# Altium schematic sheet TI_DSP.SchDoc: Sample Sheet Title
size B; Date: MM/DD/YYYY; Author: Sample Author; Organization: ORGANIZATION; Address1: ADDRESS 1; Address2: ADDRESS 2; Address3: ADDRESS 3; Address4: ADDRESS 4; Revision: -; SheetNumber: 3; SheetTotal: 6; ENG_APP_DATE: --/--/--; DSN_APP_DATE: --/--/--; CHK_APP_DATE: --/--/--
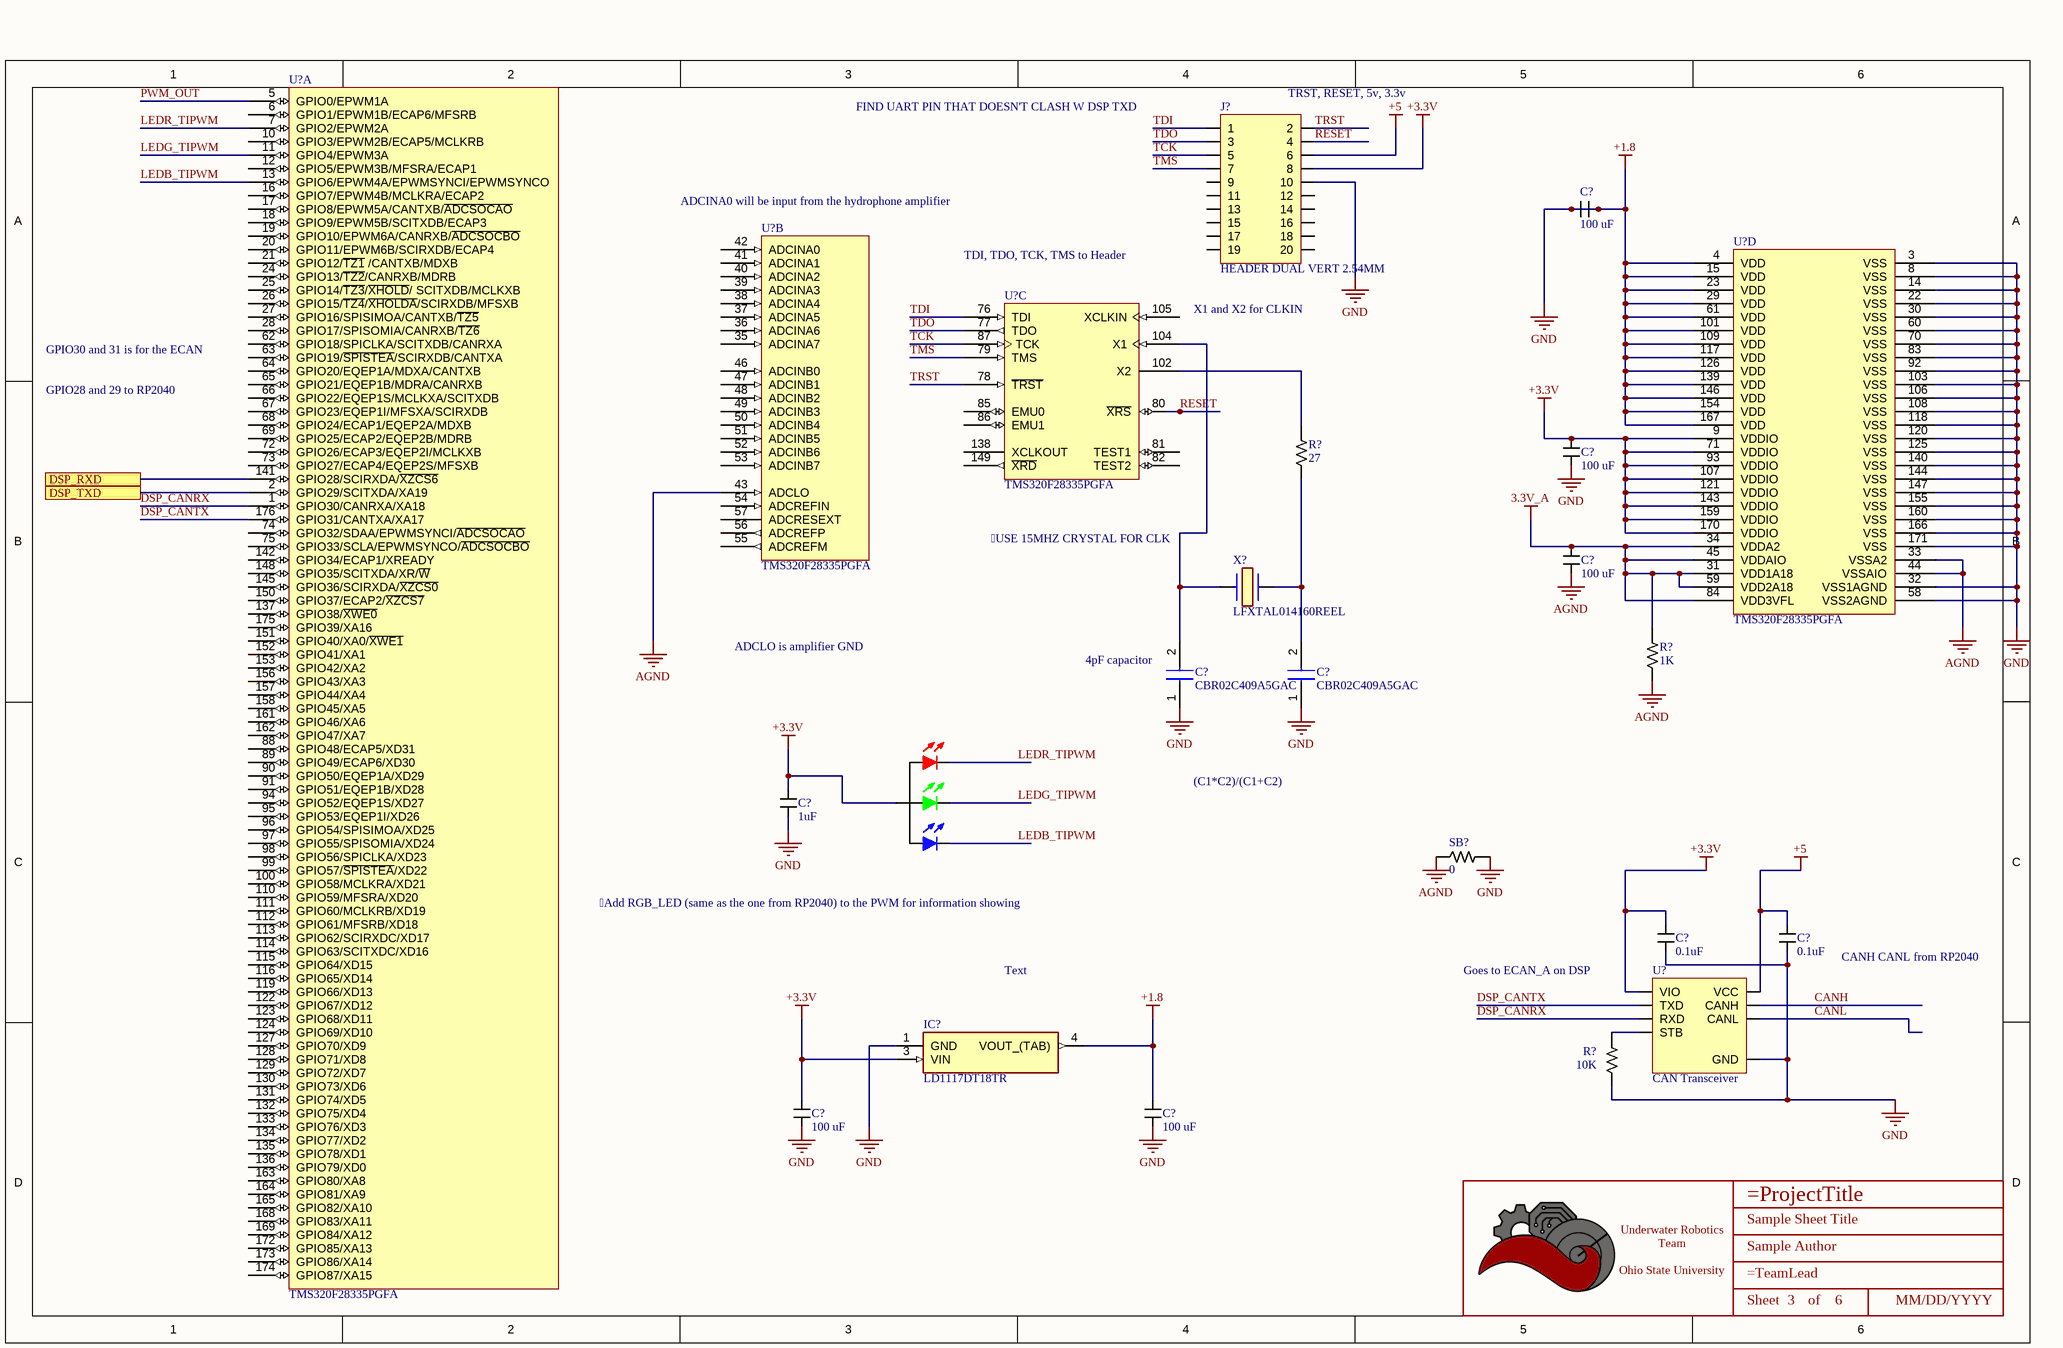
[diagram p0: TI_DSP.SchDoc]

## Parts
(Parts that share a designator on the sheet are numbered #1, #2 ... from top to bottom, then left to right.)
*  Title_Block  [LOGO]  (value not drawn)  (graphical)
C?#1  Value (uF): 100 uF  [CAPACITOR_0603]  (hidden comment: 100uF Ceramic 6.3V)
C?#2  Value (uF): 100 uF  [CAPACITOR_0603]  (hidden comment: 100uF Ceramic 6.3V)
C?#3  Value (uF): 100 uF  [CAPACITOR_0603]  (hidden comment: 100uF Ceramic 6.3V)
C?#4  CBR02C409A5GAC  [CAPC0603X33N]
C?#5  CBR02C409A5GAC  [CAPC0603X33N]
C?#6  value 1uF  [CAPACITOR_0603]  (hidden comment: 1uF Ceramic 16V)
C?#7  value 0.1uF  [CAPACITOR_0402]  (hidden comment: 100nF Ceramic 25V)
C?#8  value 0.1uF  [CAPACITOR_0402]  (hidden comment: 100nF Ceramic 25V)
C?#9  Value (uF): 100 uF  [CAPACITOR_0603]  (hidden comment: 100uF Ceramic 6.3V)
C?#10  Value (uF): 100 uF  [CAPACITOR_0603]  (hidden comment: 100uF Ceramic 6.3V)
D?  EASV3015RGBA0  [LED_4-SMD]  (value not drawn)
IC?  LD1117DT18TR  [TO228P972X240-3N]
J?  HEADER DUAL VERT 2.54MM  [HEADER_2x10PIN_2.54MM]
R?#1  Value  (Ohms): 27  [RESISTOR_0603]  (hidden comment: 27 Ohm 5% 1/8W)
R?#2  Value  (Ohms): 1K  [RESISTOR_0603]  (hidden comment: 1k Ohm 5% 1/8W)
R?#3  Value  (Ohms): 10K  [RESISTOR_0402]  (hidden comment: 10k Ohm 1% 1/16W)
SB?  Value  (Ohms): 0  [RESISTOR_0603]  (hidden comment: 0 Ohm Jumper No Fit)
U?#1  TMS320F28335PGFA  [PGF0176A_M]  (part A of 4)
U?#2  TMS320F28335PGFA  [PGF0176A_M]  (part B of 4)
U?#3  TMS320F28335PGFA  [PGF0176A_M]  (part D of 4)
U?#4  TMS320F28335PGFA  [PGF0176A_M]  (part C of 4)
U?#5  CAN Transceiver  [SOIC-8]
X?  LFXTAL014160REEL  [LFXTAL014160REEL]

## Ports
DSP_RXD, DSP_TXD

## Nets
3.3V_A: C?#3.1 R?#2.1 U?#3.31(VDD1A18) U?#3.34(VDDA2) U?#3.45(VDDAIO) U?#3.59(VDD2A18) U?#3.84(VDD3VFL)
+1.8: C?#1.1 C?#1.2 C?#2.2 C?#4.1 C?#5.1 C?#6.2 C?#7.2 C?#8.2 C?#9.2 C?#10.1 C?#10.2 IC?.1(GND) IC?.4(VOUT_(TAB)) J?.10 R?#3.2 SB?.1 U?#3.3(VSS) U?#3.4(VDD) U?#3.8(VSS) U?#3.14(VSS) U?#3.15(VDD) U?#3.22(VSS) U?#3.23(VDD) U?#3.29(VDD) U?#3.30(VSS) U?#3.32(VSS1AGND) U?#3.58(VSS2AGND) U?#3.60(VSS) U?#3.61(VDD) U?#3.70(VSS) U?#3.83(VSS) U?#3.92(VSS) U?#3.101(VDD) U?#3.103(VSS) U?#3.106(VSS) U?#3.108(VSS) U?#3.109(VDD) U?#3.117(VDD) U?#3.118(VSS) U?#3.120(VSS) U?#3.125(VSS) U?#3.126(VDD) U?#3.139(VDD) U?#3.140(VSS) U?#3.144(VSS) U?#3.146(VDD) U?#3.147(VSS) U?#3.154(VDD) U?#3.155(VSS) U?#3.160(VSS) U?#3.166(VSS) U?#3.167(VDD) U?#3.171(VSS) U?#5.2(GND)  [also labelled GND]
+3.3V: C?#2.1 C?#6.1 C?#7.1 C?#9.1 D?.1 IC?.3(VIN) J?.8 U?#3.9(VDDIO) U?#3.71(VDDIO) U?#3.93(VDDIO) U?#3.107(VDDIO) U?#3.121(VDDIO) U?#3.143(VDDIO) U?#3.159(VDDIO) U?#3.170(VDDIO) U?#5.5(VIO)
+5: C?#8.1 J?.6 U?#5.3(VCC)
AGND: C?#3.2 R?#2.2 SB?.2 U?#2.43(ADCLO) U?#3.33(VSSA2) U?#3.44(VSSAIO)
CANH: U?#5.7(CANH)
CANL: U?#5.6(CANL)
DSP_CANRX: U?#1.1(GPIO30/CANRXA/XA18) U?#5.4(RXD)
DSP_CANTX: U?#1.176(GPIO31/CANTXA/XA17) U?#5.1(TXD)
DSP_RXD: U?#1.141(GPIO28/SCIRXDA/~{XZCS6}) ; port DSP_RXD
DSP_TXD: U?#1.2(GPIO29/SCITXDA/XA19) ; port DSP_TXD
LEDB_TIPWM: D?.2 U?#1.13(GPIO6/EPWM4A/EPWMSYNCI/EPWMSYNCO)
LEDG_TIPWM: D?.3 U?#1.11(GPIO4/EPWM3A)
LEDR_TIPWM: D?.4 U?#1.7(GPIO2/EPWM2A)
PWM_OUT: U?#1.5(GPIO0/EPWM1A)
RESET: J?.4 U?#4.80(~{XRS})
TCK: J?.5 U?#4.87(TCK)
TDI: J?.1 U?#4.76(TDI)
TDO: J?.3 U?#4.77(TDO)
TMS: J?.7 U?#4.79(TMS)
TRST: J?.2 U?#4.78(~{TRST})
NetC?#4_2: C?#4.2 U?#4.104(X1) X?.1
NetC?#5_2: C?#5.2 R?#1.2 X?.2
NetR?#1_1: R?#1.1 U?#4.102(X2)
NetR?#3_1: R?#3.1 U?#5.8(STB)

Not connected (* = marked no-connect by the designer): J? 9 11 12 13 14 15 16 17 18 19 20; U?#1 6(GPIO1/EPWM1B/ECAP6/MFSRB) 10(GPIO3/EPWM2B/ECAP5/MCLKRB) 12(GPIO5/EPWM3B/MFSRA/ECAP1) 16(GPIO7/EPWM4B/MCLKRA/ECAP2) 17(GPIO8/EPWM5A/CANTXB/~{ADCSOCAO}) 18(GPIO9/EPWM5B/SCITXDB/ECAP3) 19(GPIO10/EPWM6A/CANRXB/~{ADCSOCBO}) 20(GPIO11/EPWM6B/SCIRXDB/ECAP4) 21(GPIO12/~{TZ1}_/CANTXB/MDXB) 24(GPIO13/~{TZ2}/CANRXB/MDRB) 25(GPIO14/~{TZ3}/~{XHOLD}/_SCITXDB/MCLKXB) 26(GPIO15/~{TZ4}/~{XHOLDA}/SCIRXDB/MFSXB) 27(GPIO16/SPISIMOA/CANTXB/~{TZ5}) 28(GPIO17/SPISOMIA/CANRXB/~{TZ6}) 62(GPIO18/SPICLKA/SCITXDB/CANRXA) 63(GPIO19/~{SPISTEA}/SCIRXDB/CANTXA) 64(GPIO20/EQEP1A/MDXA/CANTXB) 65(GPIO21/EQEP1B/MDRA/CANRXB) 66(GPIO22/EQEP1S/MCLKXA/SCITXDB) 67(GPIO23/EQEP1I/MFSXA/SCIRXDB) 68(GPIO24/ECAP1/EQEP2A/MDXB) 69(GPIO25/ECAP2/EQEP2B/MDRB) 72(GPIO26/ECAP3/EQEP2I/MCLKXB) 73(GPIO27/ECAP4/EQEP2S/MFSXB) 74(GPIO32/SDAA/EPWMSYNCI/~{ADCSOCAO}) 75(GPIO33/SCLA/EPWMSYNCO/~{ADCSOCBO}) 88(GPIO48/ECAP5/XD31) 89(GPIO49/ECAP6/XD30) 90(GPIO50/EQEP1A/XD29) 91(GPIO51/EQEP1B/XD28) 94(GPIO52/EQEP1S/XD27) 95(GPIO53/EQEP1I/XD26) 96(GPIO54/SPISIMOA/XD25) 97(GPIO55/SPISOMIA/XD24) 98(GPIO56/SPICLKA/XD23) 99(GPIO57/~{SPISTEA}/XD22) 100(GPIO58/MCLKRA/XD21) 110(GPIO59/MFSRA/XD20) 111(GPIO60/MCLKRB/XD19) 112(GPIO61/MFSRB/XD18) 113(GPIO62/SCIRXDC/XD17) 114(GPIO63/SCITXDC/XD16) 115(GPIO64/XD15) 116(GPIO65/XD14) 119(GPIO66/XD13) 122(GPIO67/XD12) 123(GPIO68/XD11) 124(GPIO69/XD10) 127(GPIO70/XD9) 128(GPIO71/XD8) 129(GPIO72/XD7) 130(GPIO73/XD6) 131(GPIO74/XD5) 132(GPIO75/XD4) 133(GPIO76/XD3) 134(GPIO77/XD2) 135(GPIO78/XD1) 136(GPIO79/XD0) 137(GPIO38/~{XWE0}) 142(GPIO34/ECAP1/XREADY) 145(GPIO36/SCIRXDA/~{XZCS0}) 148(GPIO35/SCITXDA/XR/~{W}) 150(GPIO37/ECAP2/~{XZCS7}) 151(GPIO40/XA0/~{XWE1}__) 152(GPIO41/XA1) 153(GPIO42/XA2) 156(GPIO43/XA3) 157(GPIO44/XA4) 158(GPIO45/XA5) 161(GPIO46/XA6) 162(GPIO47/XA7) 163(GPIO80/XA8) 164(GPIO81/XA9) 165(GPIO82/XA10) 168(GPIO83/XA11) 169(GPIO84/XA12) 172(GPIO85/XA13) 173(GPIO86/XA14) 174(GPIO87/XA15) 175(GPIO39/XA16); U?#2 35(ADCINA7) 36(ADCINA6) 37(ADCINA5) 38(ADCINA4) 39(ADCINA3) 40(ADCINA2) 41(ADCINA1) 42(ADCINA0) 46(ADCINB0) 47(ADCINB1) 48(ADCINB2) 49(ADCINB3) 50(ADCINB4) 51(ADCINB5) 52(ADCINB6) 53(ADCINB7) 54(ADCREFIN) 55(ADCREFM) 56(ADCREFP) 57(ADCRESEXT); U?#4 81(TEST1) 82(TEST2) 85(EMU0) 86(EMU1) 105(XCLKIN) 138(XCLKOUT) 149(~{XRD})

## Notes on the sheet
- FIND UART PIN THAT DOESN'T CLASH W DSP TXD
- (near J?) TRST, RESET, 5v, 3.3v
- (near U?#2) ADCINA0 will be input from the hydrophone amplifier
- TDI, TDO, TCK, TMS to Header
- GPIO30 and 31 is for the ECAN
- X1 and X2 for CLKIN
- GPIO28 and 29 to RP2040
- USE 15MHZ CRYSTAL FOR CLK
- ADCLO is amplifier GND
- (near C?#4) 4pF capacitor
- (C1*C2)/(C1+C2)
- Add RGB_LED (same as the one from RP2040) to the PWM for information showing
- CANH CANL from RP2040
- Text
- Goes to ECAN_A on DSP
- DWG. NO.
- REV.
- SHT.
- THIS DOCUMENT AND THE DATA DISCLOSED HEREIN OR HEREWITH IS THE PROPERTY OF ALTIUM LIMITED AND MAY BE FREELY DISTRIBUTED IN WHOLE. NO RIGHTS ARE RESERVED OR EXPRESS OR IMPLIED WARANTEE GIVEN.
- REVISION
- DESCRIPTION
- DATE
- APPROVED
- ENG:
- APPROVALS
- PROJECT
- DSN:
- CHK:
- REFERENCE DOCUMENTS
- PROJECT REVISION:
- TITLE
- DOCUMENT REVISION:
- DESIGN ITEM:
- BOM:
- FAB DWG:
- PCB DWG:
- ASSY DWG:
- SCALE:
- SIZE
- B
- CAGE CODE
- FILE NAME
- DWG NO.
- SHEET
- OF
- REV
- (in symbol Title_Block) Underwater Robotics Team / Ohio State University; Sheet; of

## Library data of the parts
* = Title_Block: UWRT Schematic Title Block Template / Created June 2021, Dylan Trainor
C?#1-C?#3 C?#9 C?#10 = CAPACITOR_100uF_0603: Cap 100uF 6.3V +/-20% / Ceramic 0603; Made By: Dylan Trainor; ComponentLink1Description: Digikey; ComponentLink1URL: https://www.digikey.com/en/products/detail/samsung-electro-mechanics/CL10A106MQ8NNNC/3886777; Tolerance: +/- 20%; Voltage: 6.3V; Supplier 1: RSComponents; Supplier Part Number 1: 6911206
C?#4 C?#5 = CBR02C409A5GAC: Capacitor; Manufacturer_Name: KEMET; Datasheet Link: http://www.kemet.com/Lists/ProductCatalog/Attachments/490/KEM_C1030_CBR_SMD.pdf; Height: 0.33mm; Manufacturer_Part_Number: CBR02C409A5GAC
C?#6 = CAPACITOR_1uF_0603: Cap 1uF 16V +/-10% / Ceramic 0603; Made By: Flip B; Tolerance: +/- 10%; Voltage: 16V; Supplier 1: Digi-Key; Supplier Part Number 1: 399-7847-1-ND
C?#7 C?#8 = CAPACITOR_0.1uF_0402: Cap 100nF 25V +/-10% / Ceramic 0402; Made By: Robert Pafford; Tolerance: +/- 10%; Voltage: 25V; Supplier 1: Digi-Key; Supplier Part Number 1: 478-7868-1-ND
D? = LED_RGB_RA_4SMD: LED RGB CLEAR 4SMD R/A; Made By: Robert Pafford; Red Forward Voltage: 2.0V; Red Forward Current: 25mA; Green Forward Voltage: 3.3V; Blue Forward Current: 20mA; ComponentLink1Description: Datasheet; ComponentLink1URL: https://everlightamericas.com/index.php?controller=attachment&id_attachment=3220; Package: 4-SMD; Green Forward Current: 25mA; Blue Forward Voltage: 3.3V; Color: RGB; Supplier 1: Digi-Key; Supplier Part Number 1: 1080-1502-1-ND; Supplier 2: Mouser; Supplier Part Number 2: 638-EASV3015RGBA0
IC? = LD1117DT18TR: Integrated Circuit; Manufacturer_Name: STMicroelectronics; Datasheet Link: http://www.st.com/st-web-ui/static/active/en/resource/technical/document/datasheet/CD00000544.pdf; Height: 2.4mm; Manufacturer_Part_Number: LD1117DT18TR; Mouser Part Number: 511-LD1117DT18-TR; Mouser Price/Stock: https://www.mouser.co.uk/ProductDetail/STMicroelectronics/LD1117DT18TR?qs=rkyzKKi%2FrgiTGfkwrcFd%252BA%3D%3D; Arrow Part Number: LD1117DT18TR; Arrow Price/Stock: https://www.arrow.com/en/products/ld1117dt18tr/stmicroelectronics?region=nac
J? = HEADER_2x10PIN_2.54MM: CONN HEADER VERT 20POS 2.54MM; Made By: Tyson Nguyen; Supplier 1: Digi-Key; Supplier Part Number 1: Z8747-ND
R?#1 = RESISTOR_27_0603: RES 27 OHM 5% 1/8W 0603; Tolerance: +/- 5%; Made By: Robert Pafford; ComponentLink1Description: Datasheet; ComponentLink1URL: https://www.bourns.com/docs/product-datasheets/CRxxxxx.pdf; Wattage: 1/8W; Supplier: Digikey; Digikey Part Numer: CR0603-JW-104ELFTR-ND; Supplier 1: Digi-Key; Supplier Part Number 1: 2019-RK73B1JTTD270JCT-ND
R?#2 = RESISTOR_1K_0603: RES 1k OHM 5% 1/8W 0603; Tolerance: +/- 5%; Made By: Robert Pafford; ComponentLink1Description: Datasheet; ComponentLink1URL: https://www.bourns.com/docs/product-datasheets/CRxxxxx.pdf; Wattage: 1/8W; Supplier: Digikey; Digikey Part Numer: CR0603-JW-104ELFTR-ND; Supplier 1: Digi-Key; Supplier Part Number 1: 2019-RK73B1JTTD102JCT-ND
R?#3 = RESISTOR_10K_0402: RES 10k OHM 1% 1/16W 0402; Tolerance: +/- 1%; Made By: Robert Pafford; Wattage: 1/16W; Supplier: Digikey; Digikey Part Numer: CR0603-JW-104ELFTR-ND; Supplier 1: Digi-Key; Supplier Part Number 1: YAG3436CT-ND
SB? = JUMPER_0_0603: 0 Ohm Jumper No Fit for Solder Bridge; Made By: Robert Pafford; ComponentLink1Description: Digikey; ComponentLink1URL: https://www.digikey.com/en/products/detail/koa-speer-electronics-inc/RK73B1JTTD101J/9844701
U?#1-U?#4 = CMP-0546-00022-3: Delfino Microcontroller, 1.9 V Core, 3.3 V I/O Design, 256 K x 16 Flash, 34 K x 16 SARAM, 12-Bit ADC, 16 Channels, -40 to 85 degC, 176-pin LQFP (PGF), Green (RoHS & no Sb/Br); Manufacturer: Texas Instruments; 12-Bit ADC No. Of Channels: 16; SPI: 1; GPIO: 88; Frequency (MHz): 150; CAN: 2; ComponentLink2Description: Datasheet; ComponentLink3URL: http://www.ti.com/lit/ml/mtqf020a/mtqf020a.pdf; Mounting Technology: Surface Mount; ComponentLink1Description: Manufacturer URL; I2C: 1; PartNumber: TMS320F28335PGFA; PackageVersion: 4040134/B; ComponentLink2URL: http://www.ti.com/lit/ds/symlink/tms320f28335.pdf; ComponentLink1URL: http://www.ti.com/; Eco Plan: Green (RoHS & no Sb/Br); PackageDescription: 176-Pin Plastic Quad Flatpack, Body 24 x 24 mm, Pitch 0.5 mm; ComponentLink3Description: Package Specification; Operating Temperature: -40 to 85 degC; DatasheetVersion: SPRS439M; PackageReference: PGF0176A
U?#5 = TJA1442AT: CAN Interface IC High-Speed CAN Transceiver with Standby Mode; Made By: Robert Pafford; Max Data Rate: 5Mbps; Supplier 1: Mouser; Supplier Part Number 1: 771-TJA1442AT/0Z
X? = LFXTAL014160REEL: Industry standard low cost SMD crystal package Low profile versions available SMD version of model HC49/4H; Manufacturer_Name: IQD; Geometry.Height: 4.3mm; Mouser Part Number: *; Mouser Price/Stock: *; Manufacturer_Part_Number: LFXTAL014160REEL; Datasheet Link: https://www.iqdfrequencyproducts.com/products/details/hc49-4hsmx.pdf